# Altium schematic sheet DSO_Clock.SchDoc: Schematic_Name
size A4; CompanyName: University of Melbourne; Engineer: Your Name Here; DocumentNumber: 1; Revision: 0.1; SheetNumber: 1; SheetTotal: 1; Title_Project: Project_Title; StudentNo: Student No.
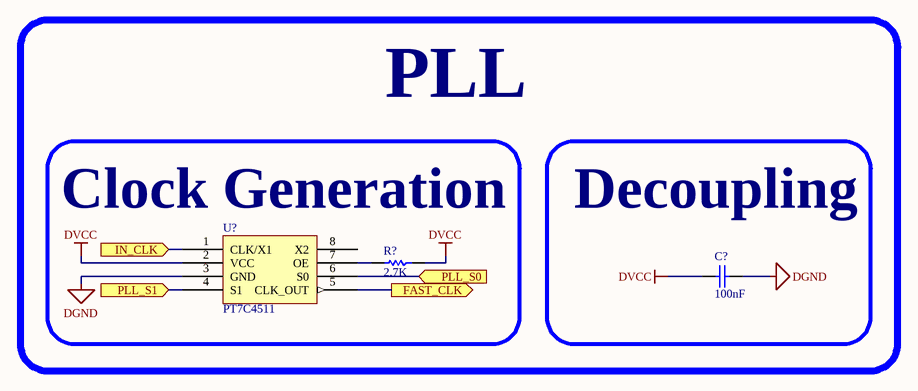
[diagram p0: DSO_Clock.SchDoc]

## Parts
C?  100nF  [0805C]
R?  2.7K  [0805]
U?  PT7C4511  [SOIC-8]

## Blocks framed on the sheet
Clock Generation: R? U?
Decoupling: C?

## Ports
FAST_CLK (out), IN_CLK (in), PLL_S0 (in), PLL_S1 (in)

## Nets
DGND: C?.1 U?.3(GND)
DVCC: C?.2 R?.1 U?.2(VCC)
FAST_CLK: U?.5(CLK_OUT) ; port FAST_CLK
IN_CLK: U?.1(CLK/X1) ; port IN_CLK
PLL_S0: U?.6(S0) ; port PLL_S0
PLL_S1: U?.4(S1) ; port PLL_S1
NetR?_2: R?.2 U?.7(OE)

Not connected (* = marked no-connect by the designer): U? 8(X2)

## Notes on the sheet
- PLL

## Library data of the parts
C? = C: Capacitor; Reviewed by: RM - 2018/08/05; Revision: July-2002: Re-released for DXP Platform.; Supplier 1: *; Supplier Part Number 1: *; Value: 100nF
R? = R: Resistor; Reviewed by: RM - 2018/08/05; Supplier 1: *; Suppler Part Number 1: *; Value: 2.7K
U? = PT7C4511: PLL Clock Multiplier; Reviewed by: RM - 2018/08/05; Supplier 1: Digi-Key; Supplier Part Number 1: PT7C4511WEXDICT-ND